# EAGLE design Bluetooth (EAGLE 5.04)
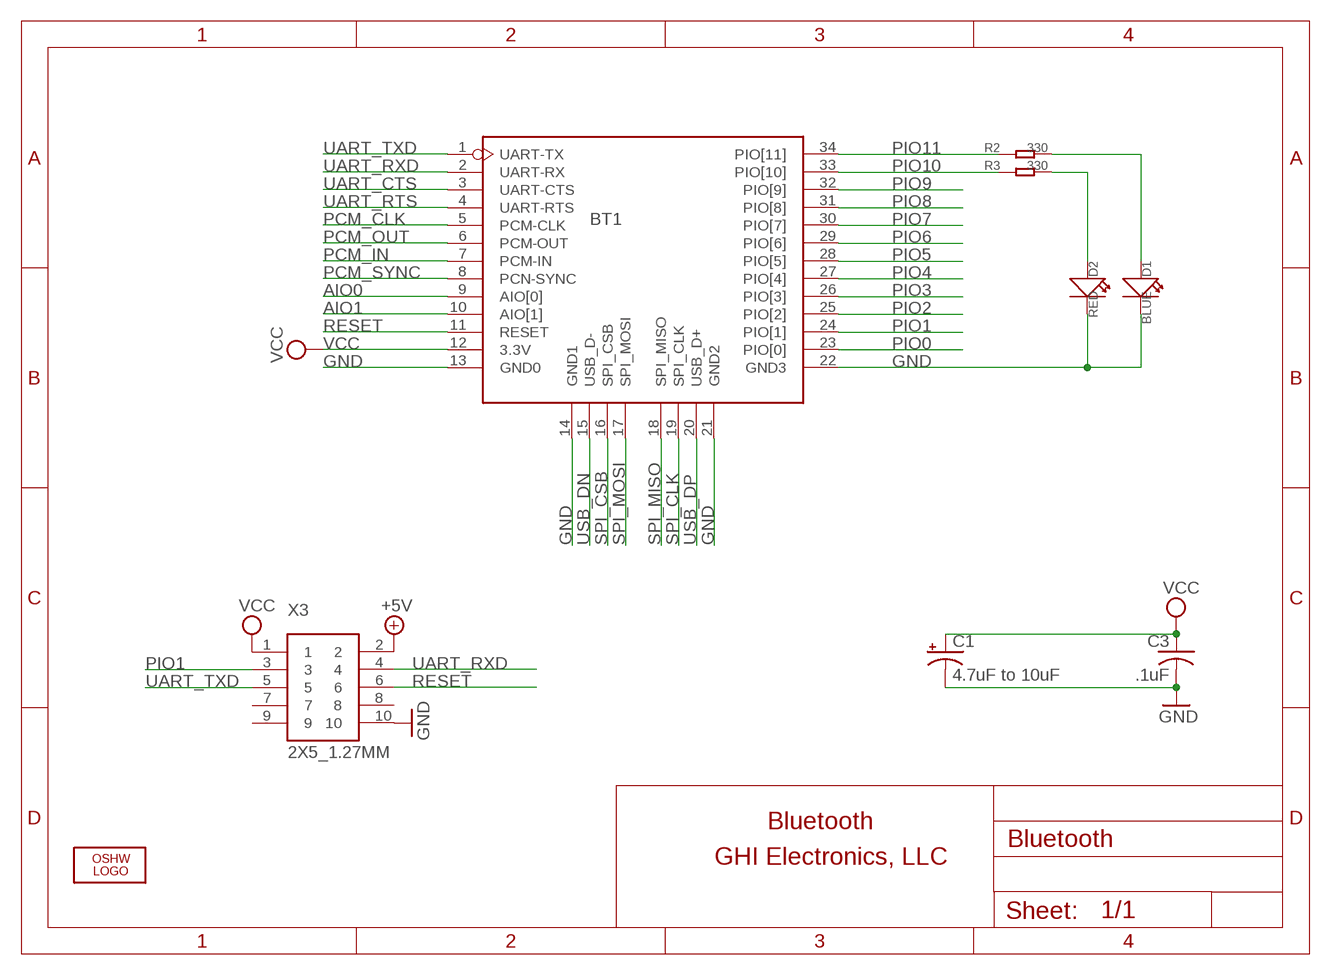
[diagram p0: schematic, sheet 1]

## Parts
BT1  SERIAL_BLUETEETHSMT  [SERIAL_BLUETEETH]
C1  4.7uF to 10uF  CPOL-USCT3528  [CT3528]
C3  .1uF  C-USC0603K  [C0603K]
D1  BLUE  LED0603  [LED0603]
D2  RED  LED0603  [LED0603]
LOGO2  LOGO-OSHW-FILLX0200-NT  [OSHW_FILLX200_NOTEXT]
R2  330  R0603  [0603]
R3  330  R0603  [0603]
X3  2X5_1.27MM  [2X5_1.27MM]

## Nets
+5V [power]: X3.2
AIO0: BT1.9(AIO[0])
AIO1: BT1.10(AIO[1])
GND [power]: BT1.13(GND0) BT1.14(GND1) BT1.21(GND2) BT1.22(GND3) C1.- C3.2 D1.2(-) D2.2(-) X3.10
N$6: D2.1(+) R3.2
N$7: D1.1(+) R2.2
PCM_CLK: BT1.5(PCM-CLK)
PCM_IN: BT1.7(PCM-IN)
PCM_OUT: BT1.6(PCM-OUT)
PCM_SYNC: BT1.8(PCN-SYNC)
PIO0: BT1.23(PIO[0])
PIO1: BT1.24(PIO[1]) X3.3
PIO2: BT1.25(PIO[2])
PIO3: BT1.26(PIO[3])
PIO4: BT1.27(PIO[4])
PIO5: BT1.28(PIO[5])
PIO6: BT1.29(PIO[6])
PIO7: BT1.30(PIO[7])
PIO8: BT1.31(PIO[8])
PIO9: BT1.32(PIO[9])
PIO10: BT1.33(PIO[10]) R3.1
PIO11: BT1.34(PIO[11]) R2.1
RESET: BT1.11(RESET) X3.6
SPI_CLK: BT1.19(SPI_CLK)
SPI_CSB: BT1.16(SPI_CSB)
SPI_MISO: BT1.18(SPI_MISO)
SPI_MOSI: BT1.17(SPI_MOSI)
UART_CTS: BT1.3(UART-CTS)
UART_RTS: BT1.4(UART-RTS)
UART_RXD: BT1.2(UART-RX) X3.4
UART_TXD: BT1.1(UART-TX) X3.5
USB_DN: BT1.15(USB_D-)
USB_DP: BT1.20(USB_D+)
VCC [power]: BT1.12(3.3V) C1.+ C3.1 X3.1
Unconnected: X3.7 X3.8 X3.9

## Notes on the sheet
- Bluetooth
- GHI Electronics, LLC

## Library data of the parts
BT1 = EXT_moudle:SERIAL_BLUETEETH
C1 = rcl:CPOL-US: POLARIZED CAPACITOR, American symbol
C3 = rcl:C-US: CAPACITOR, American symbol
D1 D2 = CPT_SMD:LED0603
LOGO2 = Logo:LOGO-OSHW-FILL
R2 R3 = CPT_SMD:R0603
X3 = GHI:2X5_1.27MM

## Net classes
0 default: width 0.254 mm, drill 0.381 mm, clearance 0.203 mm

## Board
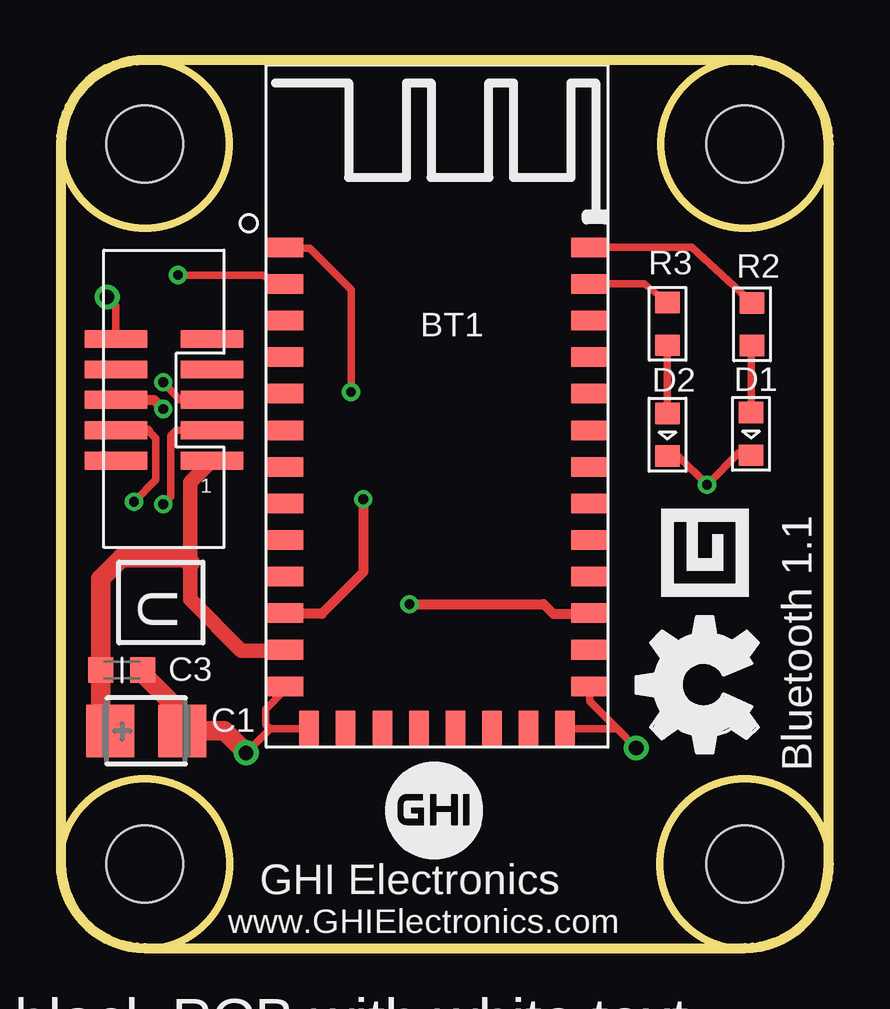
[diagram p1: board, top side]
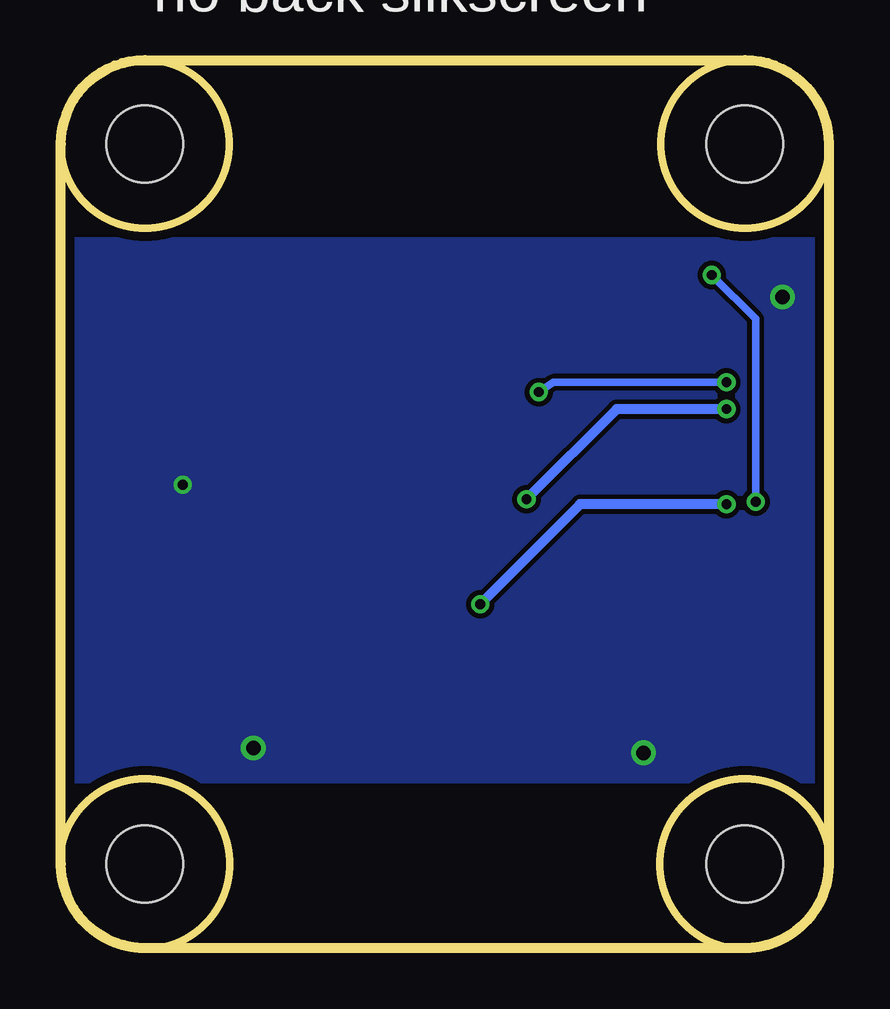
[diagram p2: board, bottom side, seen from below]

Size 32.07 x 37.04 mm. Coordinates in mm from the lower left corner, seen from the top.
Outline: 28.54,0.04 arc90 32.04,3.54 32.04,33.54 arc90 28.54,37.04 3.54,37.04 arc90 0.04,33.54 0.04,3.54 arc90 3.54,0.04 28.54,0.04
Outline: circle at 3.54,33.54 radius 3.5
Outline: circle at 28.54,33.54 radius 3.5
Outline: circle at 28.54,3.54 radius 3.54
Outline: circle at 3.54,3.54 radius 3.54
Copper layers (1+16): Top 0.035mm / dielectric 1.5mm / Bottom 0.035mm
Design rules "default *": minimum track width 8mil, minimum drill 12mil, track to track 8mil, track to pad 8mil, pad to pad 8mil, via to via 8mil, smd to smd 8mil, copper to edge 15mil, drill to drill 8mil, minimum pad ring 10mil, minimum via ring 7mil, stop-mask expansion 4mil, vias tented up to drill 50mil, thermal gap 10mil
Holes 3.2 mm at 3.54,3.54 28.54,33.54 3.54,33.54 28.54,3.54

### Footprints (pad centres in the part's own frame; a part is rotated, then mirrored left to right if it is on the bottom)
SERIAL_BLUETEETH = smd 1.524 x 0.813: 1 -6.35,0; 2 -6.35,-1.524; 3 -6.35,-3.048; 4 -6.35,-4.572; 5 -6.35,-6.096; 6 -6.35,-7.62; 7 -6.35,-9.144; 8 -6.35,-10.668; 9 -6.35,-12.192; 10 -6.35,-13.716; 11 -6.35,-15.24; 12 -6.35,-16.764; 13 -6.35,-18.288; 22 6.35,-18.288; 23 6.35,-16.764; 24 6.35,-15.24; 25 6.35,-13.716; 26 6.35,-12.192; 27 6.35,-10.668; 28 6.35,-9.144; 29 6.35,-7.62; 30 6.35,-6.096; 31 6.35,-4.572; 32 6.35,-3.048; 33 6.35,-1.524; 34 6.35,0 | smd 0.813 x 1.524: 14 -5.334,-20.066; 15 -3.81,-20.066; 16 -2.286,-20.066; 17 -0.762,-20.066; 18 0.762,-20.066; 19 2.286,-20.066; 20 3.81,-20.066; 21 5.334,-20.066
CT3528 = smd 2 x 2.2: + 1.5,0; - -1.5,0
C0603K = smd 1.05 x 1.08: 1 -0.875,0; 2 0.875,0
LED0603 = smd 0.889 x 1.016: 1 -0.889,0; 2 0.889,0
0603 = smd 0.889 x 1.016: 1 -0.889,0; 2 0.889,0
2X5_1.27MM = smd 2.6 x 0.74: 1 -2,2.58; 2 2,2.58; 3 -2,1.31; 4 2,1.31; 5 -2,0.04; 6 2,0.04; 7 -2,-1.23; 8 2,-1.23; 9 -2,-2.5; 10 2,-2.5

### Placement (x,y rotation side)
BT1  15.71,29.23 0 top
C1  3.59,9.08 180 top
C3  2.58,11.62 0 top
D1  28.79,21.46 270 top
D2  25.31,21.42 270 top
LOGO2  29.09,8.16 90 top
R2  28.84,26.03 270 top
R3  25.32,26.04 270 top
X3  4.33,22.91 180 top

### Tracks (layer width: path | path; a pad name or v marks a point on that pad's centre or on a via)
GND  (via drill 0.41, 0.61)
  Top 0.305: X3.10 2.33,26.8 v1.97,27.16 | 8.75,9.16 BT1.14 | v7.76,8.16 8.75,9.16 | BT1.13 9.36,10.79 8.57,9.99 8.57,9.35 8.75,9.16 | BT1.21 23.22,9.16 | 23.22,9.16 v24.01,8.37 | BT1.22 22.06,10.32 23.22,9.16 | D2.2 25.77,20.53 v26.96,19.34 28.29,20.67 D1.2
  Top 0.813: v7.76,8.16 6.84,9.08 C1.- 5.22,9.2 5.22,9.69 3.45,11.45 C3.2
  pour Bottom: 0.34,29.5 31.53,29.5 31.53,7.05 0.34,7.05
N$6
  Top 0.305: D2.1 25.31,24.94 R3.2
N$7
  Top 0.305: D1.1 28.79,24.89 R2.2
PIO1  (via drill 0.41)
  Top 0.305: X3.3 4.84,21.6 4.61,21.37 4.61,18.83 v4.3,18.53
  Top 0.406: v14.56,14.36 20.15,14.36 20.56,13.95 22.03,13.95 BT1.24
  Bottom 0.406: v4.3,18.53 10.4,18.53 v14.56,14.36
PIO10
  Top 0.305: BT1.33 24.34,27.7 R3.1
PIO11
  Top 0.305: BT1.34 26.32,29.23 R2.1
RESET  (via drill 0.41)
  Top 0.406: X3.6 3.92,22.87 v4.3,22.49 | v12.63,18.73 12.63,15.68 10.91,13.95 9.4,13.95 BT1.11
  Bottom 0.406: v4.3,22.49 8.87,22.49 v12.63,18.73
UART_RXD  (via drill 0.41)
  Top 0.305: v4.91,28.08 8.47,28.08 9.08,27.67 9.33,27.67 BT1.2 | 3.66,21.6 4,21.27 4,19.54 v3.08,18.63
  Top 0.406: X3.4 3.66,21.6
  Bottom 0.305: v3.08,18.63 3.08,26.25 v4.91,28.08
UART_TXD  (via drill 0.41)
  Top 0.305: X3.5 4.99,22.87 v4.3,23.61 | v12.13,23.2 12.13,27.47 10.4,29.19 9.4,29.19 BT1.1
  Bottom 0.305: v4.3,23.61 11.52,23.61 v12.13,23.2
VCC
  Top 0.61: X3.1 6.31,20.33 5.42,19.44 5.42,16.09 5.42,14.56 7.55,12.43 9.33,12.43 BT1.12
  Top 0.813: C1.+ 1.7,9.47 C3.1 1.7,15.42 2.58,16.29 5.22,16.29 5.42,16.09

### Text on the board
tPlace: U | Bluetooth 1.1 | GHI Electronics | www.GHIElectronics.com | black PCB with white text | corner holes are nonplated | do not add manufacturing codes
bPlace: no back silkscreen
201bmp: C:/Users/Gus Issa/Desktop/GHILogo_BW.bmp